# Altium schematic sheet SENSING.SchDoc: =DocumentName
size B
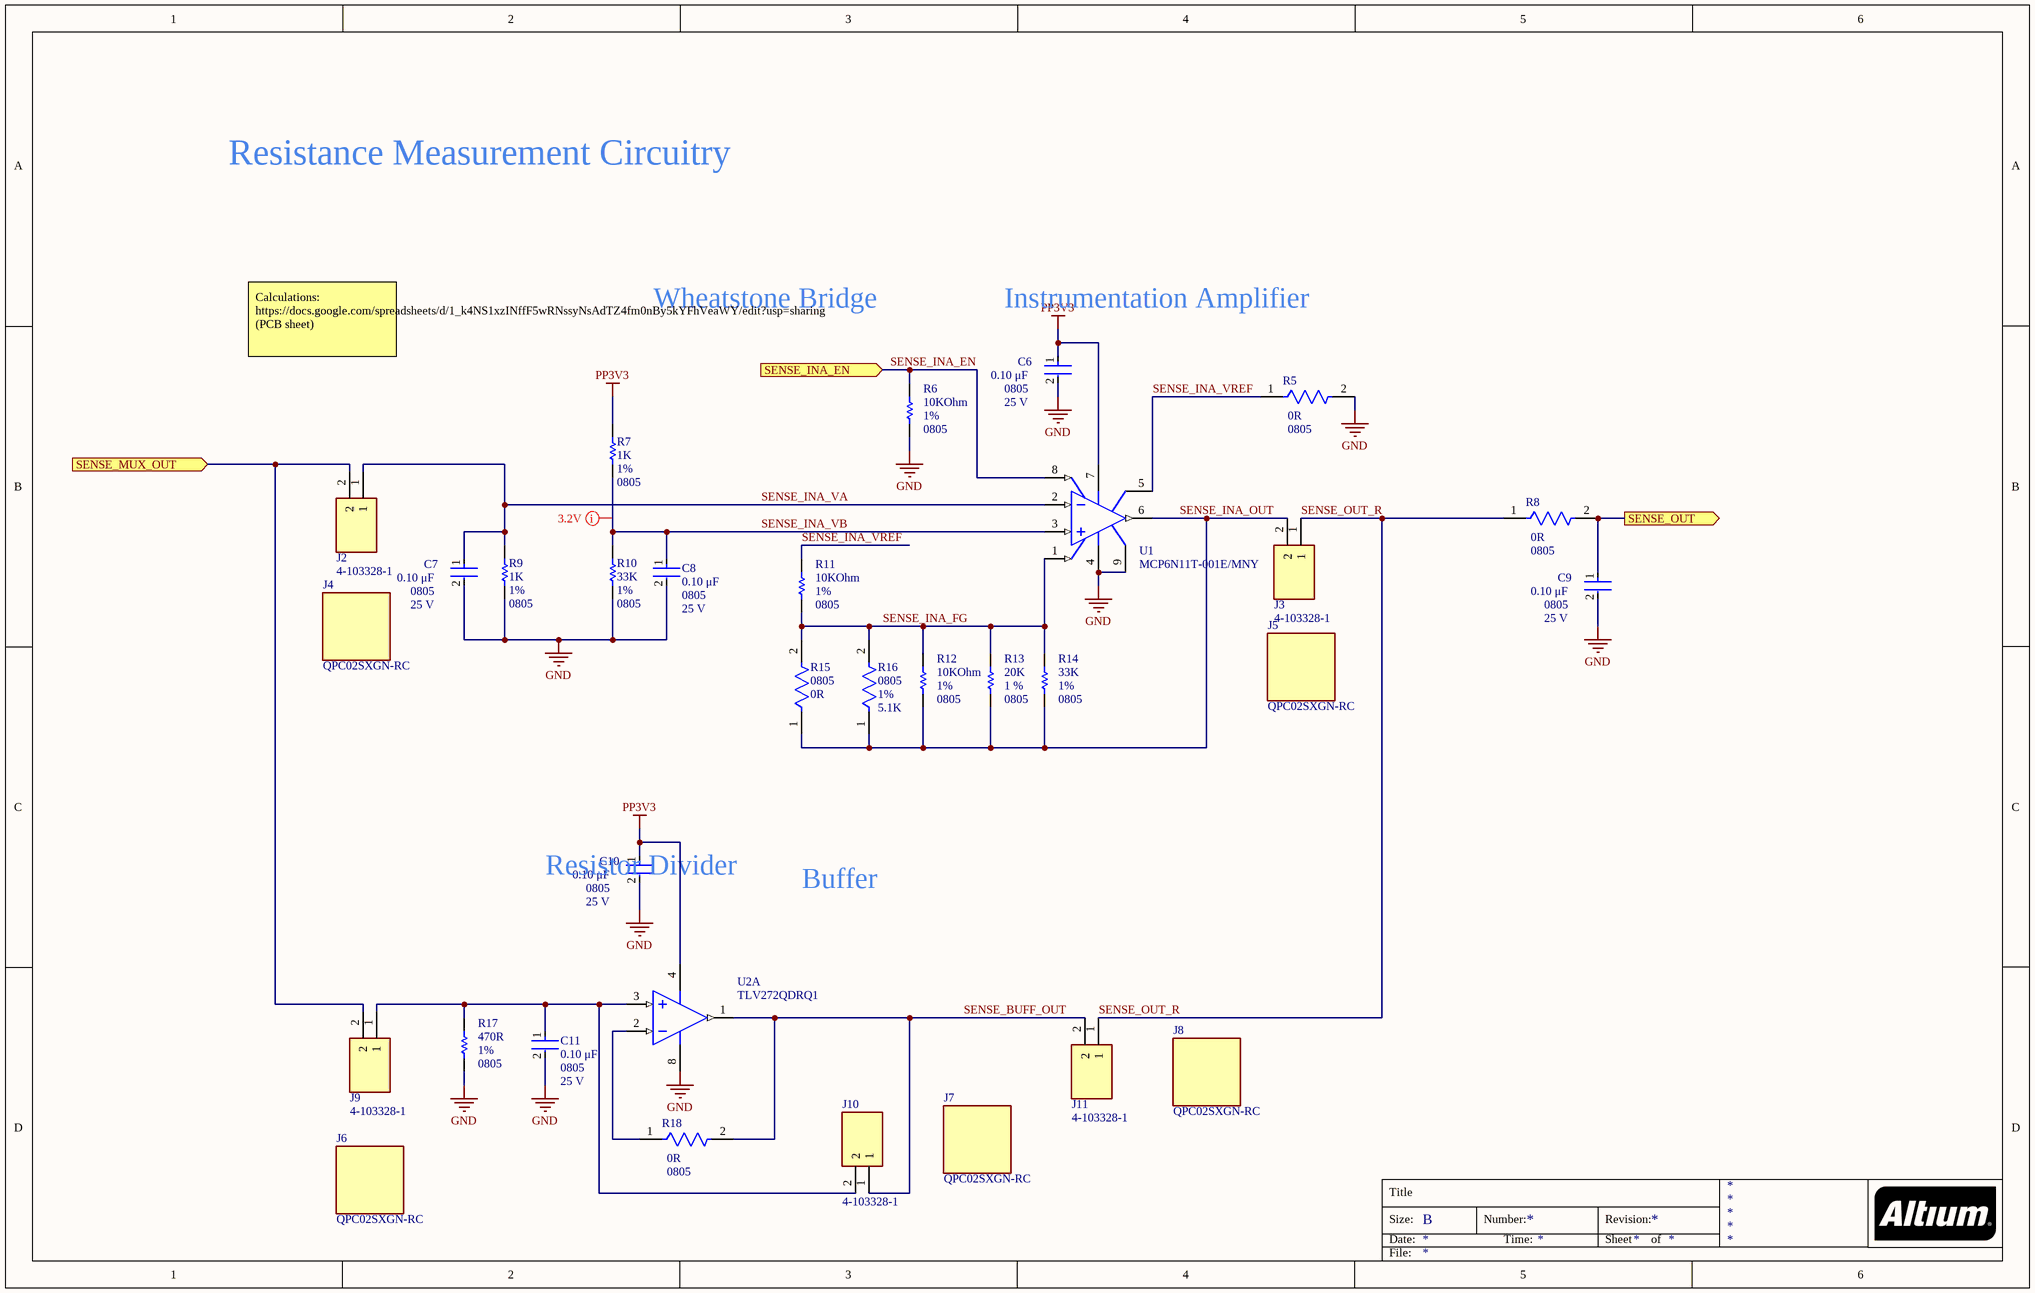
[diagram p0: SENSING.SchDoc]

## Parts
C6  Capacitance: 0.10 μF  Package: 0805  Voltage Rating: 25 V  [FP-C0805C-DN-MFG]  (hidden comment: C0805C104M3RACTU)
C7  Capacitance: 0.10 μF  Package: 0805  Voltage Rating: 25 V  [FP-C0805C-DN-MFG]  (hidden comment: C0805C104M3RACTU)
C8  Capacitance: 0.10 μF  Package: 0805  Voltage Rating: 25 V  [FP-C0805C-DN-MFG]  (hidden comment: C0805C104M3RACTU)
C9  Capacitance: 0.10 μF  Package: 0805  Voltage Rating: 25 V  [FP-C0805C-DN-MFG]  (hidden comment: C0805C104M3RACTU)
C10  Capacitance: 0.10 μF  Package: 0805  Voltage Rating: 25 V  [FP-C0805C-DN-MFG]  (hidden comment: C0805C104M3RACTU)
C11  Capacitance: 0.10 μF  Package: 0805  Voltage Rating: 25 V  [FP-C0805C-DN-MFG]  (hidden comment: C0805C104M3RACTU)
J2  4-103328-1  [TE_4-103328-1]
J3  4-103328-1  [TE_4-103328-1]
J4  QPC02SXGN-RC  [FP-QPC02SXGN-RC-MFG]
J5  QPC02SXGN-RC  [FP-QPC02SXGN-RC-MFG]
J6  QPC02SXGN-RC  [FP-QPC02SXGN-RC-MFG]
J7  QPC02SXGN-RC  [FP-QPC02SXGN-RC-MFG]
J8  QPC02SXGN-RC  [FP-QPC02SXGN-RC-MFG]
J9  4-103328-1  [TE_4-103328-1]
J10  4-103328-1  [TE_4-103328-1]
J11  4-103328-1  [TE_4-103328-1]
R5  Case/Package: 0805  Resistance: 0R  [FP-RMCF0805-MFG]  (hidden comment: RMCF0805ZT0R00)
R6  value 10KOhm  PackageReference: 0805  Tolerance: 1%  [RESC2013X60X35NL10T20]  (hidden comment: RC0805FR-0710KL)
R7  Resistance: 1K  Tolerance: 1%  Case Code (Imperial): 0805  [RESC2013X60X35ML10T20]  (hidden comment: RC0805FR-071KL)
R8  Case/Package: 0805  Resistance: 0R  [FP-RMCF0805-MFG]  (hidden comment: RMCF0805ZT0R00)
R9  Resistance: 1K  Tolerance: 1%  Case Code (Imperial): 0805  [RESC2013X60X35ML10T20]  (hidden comment: RC0805FR-071KL)
R10  value 33K  Tolerance: 1%  Package: 0805  [RESC2013X70X40LL20T20]  (hidden comment: ERJ-6GEYJ333V)
R11  value 10KOhm  PackageReference: 0805  Tolerance: 1%  [RESC2013X60X35NL10T20]  (hidden comment: RC0805FR-0710KL)
R12  value 10KOhm  PackageReference: 0805  Tolerance: 1%  [RESC2013X60X35NL10T20]  (hidden comment: RC0805FR-0710KL)
R13  value 20K  Tolerance: 1 %  Case-EIA: 0805  [RESC0805(2012)_N]  (hidden comment: 20K 1% 0805(2012))
R14  value 33K  Tolerance: 1%  Package: 0805  [RESC2013X70X40LL20T20]  (hidden comment: ERJ-6GEYJ333V)
R15  Case/Package: 0805  Resistance: 0R  [FP-RMCF0805-MFG]  (hidden comment: RMCF0805ZT0R00)
R16  Case Code (Imperial): 0805  Tolerance: 1%  Resistance: 5.1K  [FP-CRCW0805-e3-MFG]  (hidden comment: CRCW08055K10FKEA)
R17  Package Reference: 0805  Resistance Tolerance: 1%  Resistance: 470R  [RESC2013X60X35LL10T20]  (hidden comment: RC0805FR-07470RL)
R18  Case/Package: 0805  Resistance: 0R  [FP-RMCF0805-MFG]  (hidden comment: RMCF0805ZT0R00)
U1  MCP6N11T-001E/MNY  [TDFN-MN8]
U2  TLV272QDRQ1  [D0008A_N]  (part A of 2)

## Ports
SENSE_INA_EN (in), SENSE_MUX_OUT (in), SENSE_OUT (out)

## Nets
GND: C6.2 C7.2 C8.2 C9.2 C10.2 C11.2 R5.2 R6.1 R9.1 R10.1 R17.1 U1.4(VSS) U1.9(EP) U2.8(VDD)
PP3V3: C6.1 C10.1 R7.2 U1.7(VDD) U2.4(GND)
SENSE_BUFF_OUT: J10.1 J11.2 R18.2 U2.1(OUT1)
SENSE_INA_EN: R6.2 U1.8(EN/~{CAL}) ; port SENSE_INA_EN
SENSE_INA_FG: R11.1 R12.2 R13.2 R14.2 R15.2 R16.2 U1.1(VFG)
SENSE_INA_OUT: J3.2 R12.1 R13.1 R14.1 R15.1 R16.1 U1.6(VOUT)
SENSE_INA_VA: C7.1 J2.1 R9.2 U1.2(VIM)
SENSE_INA_VB: C8.1 R7.1 R10.2 U1.3(VIP)
SENSE_INA_VREF: R5.1 R11.2 U1.5(VREF)
SENSE_MUX_OUT: J2.2 J9.2 ; port SENSE_MUX_OUT
SENSE_OUT: C9.1 R8.2 ; port SENSE_OUT
SENSE_OUT_R: J3.1 J11.1 R8.1
NetC11_1: C11.1 J9.1 J10.2 R17.2 U2.3(IN1+)
NetR18_1: R18.1 U2.2(IN1-)

## Layout directives
mark named 3.2V: SENSE_INA_VB

## Notes on the sheet
- Resistance Measurement Circuitry
- Calculations: https://docs.google.com/spreadsheets/d/1_k4NS1xzINffF5wRNssyNsAdTZ4fm0nBy5kYFhVeaWY/edit?usp=sharing (PCB sheet)
- Wheatstone Bridge
- Instrumentation Amplifier
- Resistor Divider
- Buffer
- Title
- Size:
- Date:
- B
- Number:
- Time:
- Revision:
- Sheet
- of
- File:

## Library data of the parts
C6-C11 = CMP-2007-00282-2: CAP CER 0.1UF 25V 20% X7R 0805; Manufacturer: KEMET; Temperature Coefficient: 30ppm/°C; Material: Ceramic; Tolerance: 0.2; Value: 0.10 μF; Digikey Description: CAP CER 0.1UF 25V 20% X7R 0805; Device Class L2: Capacitors; Temperature: -55°C to +125°C; Device Class L1: Passive Components; ComponentLink2Description: Datasheet; Mouser Description: Multilayer Ceramic Capacitors MLCC - SMD/SMT 25volts 0.1uF X7R 20%; Temperature Range High: +125°C; Device Class L3: Ceramic Capacitors; Automotive: No; Temperature Range Low: -55°C; RoHS: TRUE; Category: Cap; Lead Free: Yes; Ipc Land Pattern Name: CAPC200125X78; Height: 0.88mm; Temperature Characteristic: X7R; Octopart: https://octopart.com/c0805c104m3ractu-kemet-9138612; ComponentLink2URL: https://content.kemet.com/datasheets/KEM_C1003_C0G_SMD.pdf; Manufacturer Part Number: C0805C104M3RACTU; Supplier: Digi-Key; Supplier Part Number: 399-C0805C104M3RAC7800CT-ND
J2 J3 J9-J11 = 4-103328-1: Connector Header Through Hole 2 position; Manufacturer: TE Connectivity AMP Connectors; MF: TE Connectivity; SnapEDA_Link: https://www.snapeda.com/parts/4-103328-1/TE%20Connectivity%20AMP%20Connectors/view-part/2384420/?ref=snap; MP: 4-103328-1; TE_purchase_URL: https://www.te.com/usa-en/product-4-103328-1.html?te_bu=Cor&te_type=disp&te_campaign=seda_glo_cor-seda-global-disp-prtnr-fy19-seda-model-bom-cta_sma-317_1&elqCampaignId=32493; Availability: Unavailable; Value: *; EU_RoHS_Compliance: Compliant; Price: None; Package: None; Supplier: Digi-Key; Supplier Part Number: A121364-ND; Manufacturer Part Number: 4-103328-1
J4-J8 = CMP-25666-000001-1: CONN JUMPER SHORTING .100" GOLD; Manufacturer: Sullins; Conn Orientation: Straight; Pitch: 2.54mm; Current Rating: 3A; Number Of Contacts: 2; Category: Conn; Temperature Range Low: -40°C; Temperature Range High: +85°C; Device Class L1: Connectors; Lead Free: Yes; Manufacturer Part Number: QPC02SXGN-RC; Automotive: No; Height: 6.17mm; ComponentLink2URL: https://s3.amazonaws.com/catalogspreads-pdf/PAGE128-129%20.100%20JUMPER.pdf; Device Class L2: unset; Footprint Url: https://drawings-pdf.s3.amazonaws.com/11510.pdf; Device Class L3: unset; Temperature: -40°C to +85°C; RoHS: TRUE; Digikey Description: CONN JUMPER SHORTING .100" GOLD; Octopart: https://octopart.com/qpc02sxgn-rc-sullins-19878795; Package: 0; ComponentLink2Description: Datasheet; Contact Material: Gold; Supplier: Digi-Key; Supplier Part Number: S9337-ND
R5 R8 R15 R18 = CMP-26527-000017-1: RES 0 OHM JUMPER 1/8W 0805; Manufacturer: Stackpole Electronics Inc; Power Rating: 125mW; Depth: 1.25mm; Length: 2mm; Military Standard: Not; Width: 0.049inch; Case Code (Imperial): 0805; Number of Terminations: 2; Mount: Surface Mount; Contact Plating: Tin; Height: 0.026inch; Min Operating Temperature: -55°C; Composition: Thick Film; Max Operating Temperature: 155°C; Packaging: Tape and Reel; Features: Automotive AEC-Q200; Max Power Dissipation: 125mW; Radiation Hardening: No; Lead Free: Lead Free; Case Code (Metric): 2012; Supplier: Digi-Key; Supplier Part Number: RMCF0805ZT0R00CT-ND; Manufacturer Part Number: RMCF0805ZT0R00
R6 R11 R12 = CMP-1659-00013-4: Chip Resistor, 10 KOhm, +/- 1%, 0.125 W, -55 to 155 degC, 0805 (2012 Metric), RoHS, Tape and Reel; Manufacturer: Yageo; Voltage Rating: 150 V; Mount: Surface Mount; ComponentLink1Description: Manufacturer URL; ComponentLink2URL: http://www.yageo.com/documents/recent/PYu-RC_Group_51_RoHS_L_04.pdf; Pins: 2; Length: 2 mm; Min Operating Temperature: -55 degC; Height: 0.5 mm; Mounting Technology: Surface Mount; RoHSCompliant: true; REACH SVHC: No SVHC; ComponentLink1URL: http://www.yageo.com/; Max Operating Temperature: 155 degC; DatasheetVersion: Rev. 4, 02/2016; Package Quantity: 5000; Packaging: Tape and Reel; ComponentLink2Description: Datasheet; PackageDescription: 2-Pin Surface Mounted Device, Body 2 x 1.25 mm; Manufacturer Part Number: RC0805FR-0710KL; Supplier: Digi-Key; Supplier Part Number: RC0805FR-0710KL
R7 R9 = CMP-2100-03671-1: Chip Resistor, 1 KOhm, +/- 1%, 125 mW, -55 to 155 degC, 0805 (2012 Metric), RoHS, Tape and Reel; Manufacturer: Yageo; Temperature Coefficient: 100ppm/degreesC; Voltage Rating (DC): 150V; Max Power Dissipation: 125mW; Number of Pins: 2; Number of Terminations: 2; Datasheet URL: http://www.yageo.com/NewPortal/yageodocoutput?fileName=/pdf/R-Chip/PYu-RC_Group_51_RoHS_L_5.pdf; Length: 0.079inch; Package Description: 2-Pin Surface Mounted Device, Body 2 x 1.25 mm; Depth: 1.25mm; Height: 0.024inch; Military Standard: Not; Case/Package: 0805; Package Reference: 0805; RoHSCompliant: true; Lead Free: LeadFree; Packaging: TapeandReel; Package Quantity: 1; Datasheet Version: Rev. 5, 10/2016; Min Operating Temperature: -55degC; Voltage Rating: 150V; Composition: ThickFilm; Power Rating: 125mW; Width: 0.049inch; Case Code (Metric): 2012; Manufacturer URL: http://www.yageo.com/; Max Operating Temperature: 155degC; REACH SVHC: Unknown; Termination: SMD/SMT; Manufacturer Part Number: RC0805FR-071KL; Supplier: Digi-Key; Supplier Part Number: 311-1.00KCRCT-ND
R10 R14 = CMP-2001-00401-1: Manufacturer: Panasonic; Part Number: ERJ-6GEYJ333V; Supplier: Digi-Key; Supplier Part Number: P33KACT-ND; Manufacturer Part Number: ERJ-6GEYJ333V
R13 = CMP-1013-00655-1: 20K 0.125W 1% 0805 (2012 Metric)  SMD; Manufacturer Part Number: RC0805FR-0720KL; Manufacturer: YAGEO; Case-Metric: 2012; Power: 0.125 W; Technology: SMT; Supplier: Digi-Key; Supplier Part Number: 311-20.0KCRCT-ND
R16 = CMP-2001-04024-2: RES Thick Film, 5.1kΩ, 1%, 0.125W, 100ppm/°C, 0805; Manufacturer: Vishay Dale; Manufacturer Part Number: CRCW08055K10FKEAC; Power Rating: 125mW; Voltage Rating (DC): 150V; Packaging: Tape and Reel; Case Code (Metric): 2012; Contact Plating: Tin; Depth: 1.25mm; Width: 0.049inch; Temperature Coefficient: 100ppm/°C; Max Power Dissipation: 125mW; Military Standard: Not; Lead Free: Lead Free; Mount: Surface Mount; Min Operating Temperature: -55°C; Package Quantity: 10; Weight: 0.000194oz; Height: 0.45mm; Number of Terminations: 2; Max Operating Temperature: 155°C; Termination: SMD/SMT; Case/Package: 0805; Composition: Thick Film; Voltage Rating: 150V; Length: 2mm; Features: Automotive AEC-Q200; Radiation Hardening: No; Supplier: Digi-Key; Supplier Part Number: 541-CRCW08055K10FKEACCT-ND
R17 = CMP-2000-06961-1: Chip Resistor, 470 Ohm, +/- 1%, 125 mW, -55 to 155 degC, 0805 (2012 Metric), RoHS, Tape and Reel; Manufacturer: Yageo; Power Rating: 250mW; Resistor Case Style: 0805[2012Metric]; Voltage Rating: 150V; Resistor Element Type: ThickFilm; Temperature Coefficient: ±100ppm/°C; SVHC: ToBeAdvised; Datasheet Version: Rev. 7, 05/2017; Automotive Qualification Standard: -; Mounting Technology: SurfaceMount; Product Range: -; Packaging: Tape&Reel; Package Description: 2-Pin Surface Mounted Device, Body 2 x 1.25 mm; MSL: MSL1-Unlimited; Datasheet URL: http://www.yageo.com/documents/recent/PYu-RC_Group_51_RoHS_L_7.pdf; Manufacturer URL: http://www.yageo.com/; Supplier: Digi-Key; Supplier Part Number: 311-470CRCT-ND; Manufacturer Part Number: RC0805FR-07470RL
U1 = CMP-0187-00751-2: None; Manufacturer: Microchip Technology; Supply Current: 800uA; Max Supply Voltage: 5.5V; Number of Circuits: 1; Input Offset Voltage (Vos): 3mV; Number of Elements: 2; Power Supply Rejection Ratio (PSRR): 62dB; Common Mode Rejection Ratio: 70dB; Unity Gain Bandwidth Product: 500kHz; Slew Rate: 9V/µs; Min Supply Voltage: 1.8V; Input Bias Current: 10pA; Height: 0.75mm; Number of Pins: 8; Min Operating Temperature: -40°C; Lead Free: Lead Free; Number of Channels: 1; REACH SVHC: No SVHC; Max Supply Current: 800uA; Gain Bandwidth Product: 500kHz; Bandwidth: 500kHz; RoHS Compliant: Yes; Length: 3mm; Number of Amplifiers: 1; Package Quantity: 3300; Width: 2mm; Mount: Surface Mount; Radiation Hardening: No; Case/Package: SOIC; Input Offset Voltage-Max: 3mV; Max Operating Temperature: 125°C; Packaging: Tape and Reel; Nominal Supply Current: 800uA; Supplier: Digi-Key; Supplier Part Number: MCP6N11T-001E/MNYCT-ND; Manufacturer Part Number: MCP6N11T-001E/MNY
U2 = CMP-0272-02933-3: Automotive Catalog 550 uA/Ch, 3 MHz, Rail-to-Rail Output Operational Amplifier, 2.7 to 16 V, -40 to 125 degC, 8-pin SOIC (D8), Green (RoHS & no Sb/Br); Manufacturer: Texas Instruments; IIB(Max)(pA): 60; Packing: LARGE T&R; Number of Channels: 2; GBW(Typ)(MHz): 3; Iq per channel(Max)(mA): 0.66; Slew Rate(Typ)(V/us): 2.4; Total Supply Voltage(Max)(+5V is 5, +/-5V is 10): 16; CMRR(Min)(dB): 58; Total Supply Voltage(Min)(+5V is 5, +/-5V is 10): 2.7; Sub Family: Low Supply Voltage Amplifier (<=2.7V), Precision Amplifier; Vio (25C)(Max)(mV): 5; PackageReference: D0008A; ComponentLink2URL: http://www.ti.com/lit/ds/symlink/tlv272-q1.pdf; ComponentLink1Description: Manufacturer URL; Mounting Technology: Surface Mount; DatasheetVersion: SGLS275A; PartNumber: TLV272QDRQ1; ComponentLink2Description: Datasheet; Offset Drift(Typ)(uV/C): 2; PackageVersion: 4040047-3/M, 06/2011; Rating: Automotive; ComponentLink1URL: http://www.ti.com/; Code_JEDEC: MS-012; ComponentLink3Description: Package Specification; ComponentLink3URL: http://www.ti.com/litv/pdf/msoi002j; PackageDescription: 8-Pin Plastic Small Outline, Body 4.9 x 3.9 mm, Pitch 1.27 mm; Eco-Plan: Green (RoHS & no Sb/Br); Manufacturer Part Number: TLV272QDRQ1; Supplier: Digi-Key; Supplier Part Number: 296-17870-1-ND